# Altium schematic sheet Mic.SchDoc
size A; SheetNumber: 1; SheetTotal: 4
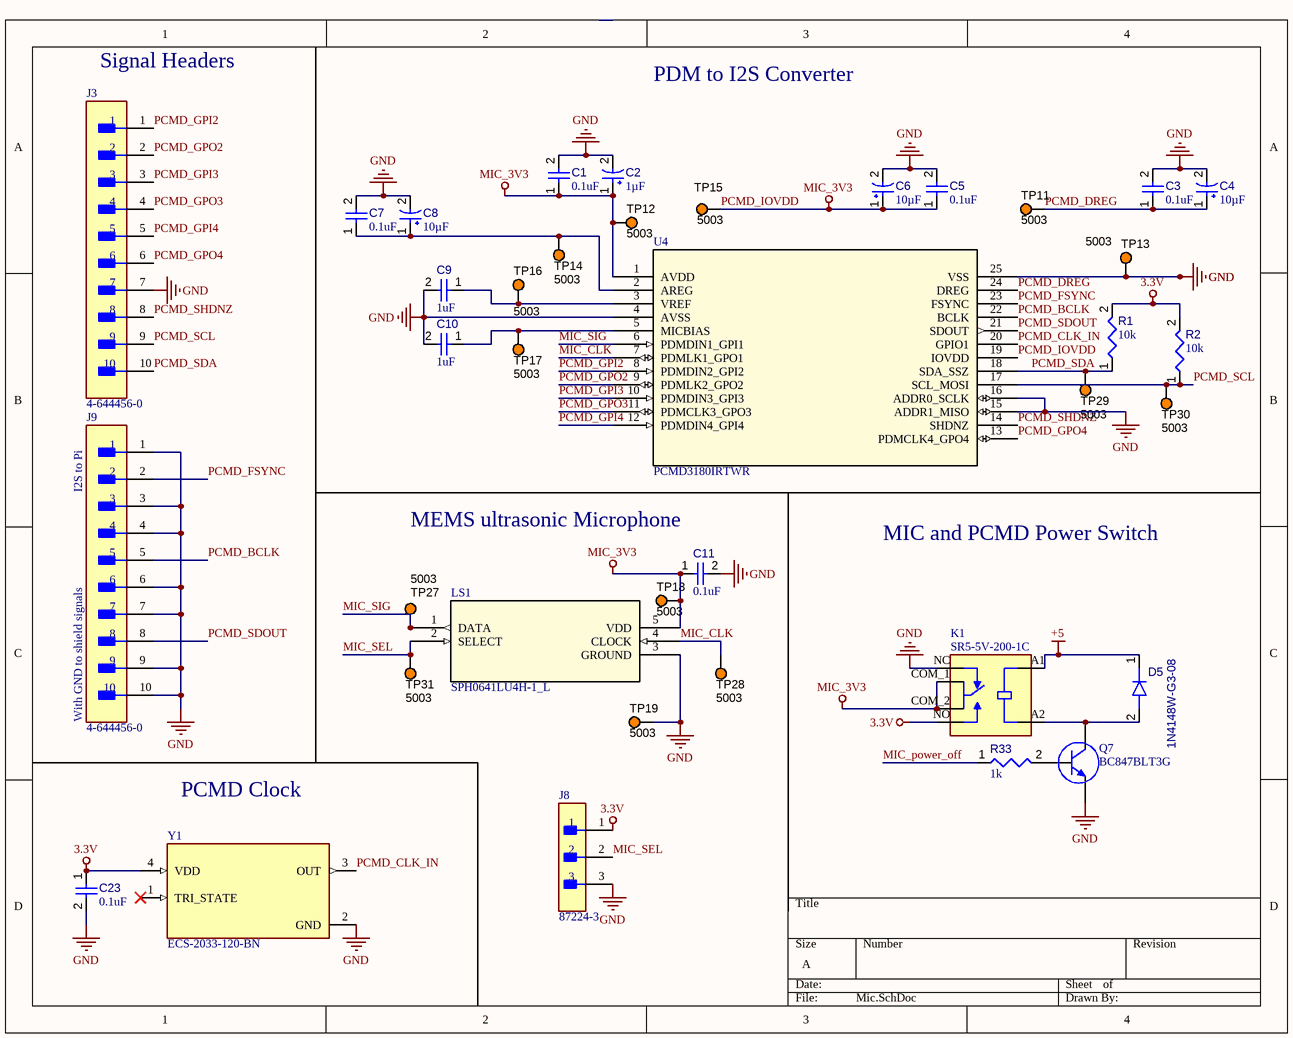
[diagram p0: Mic.SchDoc]

## Parts
C1  value 0.1uF  [CAPC1608X90X40NL10T20]  (hidden comment: Capacitor 100 nF +/-10% 50 V 0603)
C2  value 1µF  [CAPPR55-200-1100X500X1200]  (hidden comment: ECA-1HHG010)
C3  value 0.1uF  [CAPC1608X90X40NL10T20]  (hidden comment: Capacitor 100 nF +/-10% 50 V 0603)
C4  value 10µF  [CAPPR55-200-1100X500X1200]  (hidden comment: ECA-1HHG010)
C5  value 0.1uF  [CAPC1608X90X40NL10T20]  (hidden comment: Capacitor 100 nF +/-10% 50 V 0603)
C6  value 10µF  [CAPPR55-200-1100X500X1200]  (hidden comment: ECA-1HHG010)
C7  value 0.1uF  [CAPC1608X90X40NL10T20]  (hidden comment: Capacitor 100 nF +/-10% 50 V 0603)
C8  value 10µF  [CAPPR55-200-1100X500X1200]  (hidden comment: ECA-1HHG010)
C9  value 1uF  [CAPC1608X90X40NL10T20]  (hidden comment: Capacitor 100 nF +/-10% 50 V 0603)
C10  value 1uF  [CAPC1608X90X40NL10T20]  (hidden comment: Capacitor 100 nF +/-10% 50 V 0603)
C11  value 0.1uF  [CAPC1608X90X40NL10T20]  (hidden comment: Capacitor 100 nF +/-10% 50 V 0603)
C23  value 0.1uF  [CAPC1608X90X40NL10T20]  (hidden comment: Capacitor 100 nF +/-10% 50 V 0603)
D5  1N4148W-G3-08  [FP-S8-V-3910_01-001-IPC_B]
J3  4-644456-0  [FP-4-644456-0-MFG]
J8  87224-3  [FP-87224-3-MFG]
J9  4-644456-0  [FP-4-644456-0-MFG]
K1  SR5-5V-200-1C  [RELAY_SR5-5V-200-1C]
LS1  SPH0641LU4H-1_L  [SPH0655LM4H-1_KNO_L]
Q7  BC847BLT3G  [ONSC-SOT-23-3-318-08_V]
R1  value 10k  [RESC0603(1608)_L]  (hidden comment: Resistor 120R +/-5 % 0603 0.1 W)
R2  value 10k  [RESC0603(1608)_L]  (hidden comment: Resistor 120R +/-5 % 0603 0.1 W)
R33  value 1k  [RESC0603(1608)_L]  (hidden comment: Resistor 120R +/-5 % 0603 0.1 W)
TP11  5003  [KSTN-5003]
TP12  5003  [KSTN-5003]
TP13  5003  [KSTN-5003]
TP14  5003  [KSTN-5003]
TP15  5003  [KSTN-5003]
TP16  5003  [KSTN-5003]
TP17  5003  [KSTN-5003]
TP18  5003  [KSTN-5003]
TP19  5003  [KSTN-5003]
TP27  5003  [KSTN-5003]
TP28  5003  [KSTN-5003]
TP29  5003  [KSTN-5003]
TP30  5003  [KSTN-5003]
TP31  5003  [KSTN-5003]
U4  PCMD3180IRTWR  [QFN_0IRTWR_TEX]
Y1  ECS-2033-120-BN  [OSC_ECS-2033-120-BN]

## Nets
3.3V: C23.1 J8.1 K1.NO R1.2 R2.2 Y1.4(VDD)
+5: D5.1(K) K1.A1(COIL1)
GND: C1.2 C2.2 C3.2 C4.2 C5.2 C6.2 C7.2 C8.2 C9.2 C10.2 C11.2 C23.2 J3.7 J8.3 J9.1 J9.3 J9.4 J9.6 J9.7 J9.9 J9.10 K1.NC LS1.3(GROUND) Q7.1(E) TP13.1 TP19.1 U4.4(AVSS) U4.15(ADDR1_MISO) U4.16(ADDR0_SCLK) U4.25(VSS) Y1.2(GND)
PCMD_IOVDD: C1.1 C2.1 C5.1 C6.1 C11.1 K1.COM_1(COM1) K1.COM_2(COM2) LS1.5(VDD) TP12.1 TP15.1 TP18.1 U4.1(AVDD) U4.19(IOVDD)  [also labelled MIC_3V3]
MIC_CLK: LS1.4(CLOCK) TP28.1 U4.7(PDMLK1_GPO1)
MIC_power_off: R33.1
MIC_SEL: J8.2 LS1.2(SELECT) TP31.1
MIC_SIG: LS1.1(DATA) TP27.1 U4.6(PDMDIN1_GPI1)
PCMD_BCLK: J9.5 U4.22(BCLK)
PCMD_CLK_IN: U4.20(GPIO1) Y1.3(OUT)
PCMD_DREG: C3.1 C4.1 TP11.1 U4.24(DREG)
PCMD_FSYNC: J9.2 U4.23(FSYNC)
PCMD_GPI2: J3.1 U4.8(PDMDIN2_GPI2)
PCMD_GPI3: J3.3 U4.10(PDMDIN3_GPI3)
PCMD_GPI4: J3.5 U4.12(PDMDIN4_GPI4)
PCMD_GPO2: J3.2 U4.9(PDMLK2_GPO2)
PCMD_GPO3: J3.4 U4.11(PDMCLK3_GPO3)
PCMD_GPO4: J3.6 U4.13(PDMCLK4_GPO4)
PCMD_SCL: J3.9 R2.1 TP30.1 U4.17(SCL_MOSI)
PCMD_SDA: J3.10 R1.1 TP29.1 U4.18(SDA_SSZ)
PCMD_SDOUT: J9.8 U4.21(SDOUT)
PCMD_SHDNZ: J3.8 U4.14(SHDNZ)
NetC7_1: C7.1 C8.1 TP14.1 U4.2(AREG)
NetC9_1: C9.1 TP16.1 U4.3(VREF)
NetC10_1: C10.1 TP17.1 U4.5(MICBIAS)
NetD5_2: D5.2(A) K1.A2(COIL2) Q7.3(C)
NetQ7_2: Q7.2(B) R33.2

Not connected (* = marked no-connect by the designer): Y1 1(TRI_STATE)*

## Notes on the sheet
- Signal Headers
- PDM to I2S Converter
- (near J9) I2S to Pi
- (near C11) MEMS ultrasonic Microphone
- MIC and PCMD Power Switch
- (near J9) With GND to shield signals
- PCMD Clock

## Library data of the parts
C1 C3 C5 C7 C9-C11 C23 = CMP-001-00017-6: Chip Capacitor, 100 nF, +/- 10%, 50 V, 0603 (1608 Metric); Voltage Rating: 50V; Capacitor Type: Ceramic; Tolerance: 10%; Mounting Technology: SM; Max Operating Temperature: 125°C; RoHS Compliant: True; Pins: 2; Case/Package: 0603; Min Operating Temperature: -55°C
C2 C4 C6 C8 = CMP-001-00024-7: Aluminum Electrolytic Capacitor, 1 uF, +/- 20%, 50 V, -55 to 105 degC, 2-Pin THD, RoHS, Bulk; Manufacturer: Panasonic; Voltage Rating: 50V; Ripple Current: 10mA; Packaging: Bulk; Package Quantity: 200; Tolerance: 20%; Min Operating Temperature: -55°C; Diameter: 5mm; Capacitor Type: Electrolytic; Datasheet Version: Mar-05; Ripple Current (AC): 10mA; Manufacturer URL: http://www.panasonic.com/; Case/Package: Radial; Mounting Technology: TH; Pins: 2; Package Reference: CAPPR55-200-1100X500X1200; Package Description: 2-Pin Radial Lead, Dia 5 mm, Height 12 mm; RoHS Compliant: True; Max Operating Temperature: 105°C; Lead Pitch: 2mm; Datasheet URL: https://datasheet.ciiva.com/7275/94060-7275472.pdf
D5 = CMP-004-00034-1: Rectifier Diode, 1 Phase, 1 Element, 0.15A, 100V V(RRM), Silicon
J3 J9 = CMP-002-00072-1: Board Connector, 10 Contact(s), 1 Row(s), Male, Straight, 0.1 inch Pitch, Solder Terminal, Natural Insulator, Plug; Min Operating Temperature: -55°C; RoHS Compliant: Yes; Mounting Technology: Board; Max Operating Temperature: 105°C; Connector Type: BOARD CONNECTOR
J8 = CMP-002-00078-1: Board Connector, 3 Contact(s), 1 Row(s), Male, Straight, 0.1 inch Pitch, Solder Terminal, Black Insulator, Receptacle; Mounting Technology: Board; Max Operating Temperature: 105°C; RoHS Compliant: Yes; Connector Type: BOARD CONNECTOR; Min Operating Temperature: -65°C
K1 = CMP-029-000000-1: 15.6 x 10.6 x 11.8 mm, 5 V, 1 A, SPDT (1 Form C), Through Hole, Signal Relay; MF: CUI Devices; Pin Count: 6; Component Type: Standard; MP: SR5-5V-200-1C; Design Item ID: SR5-5V-200-1C; Package: None; CUI_purchase_URL: https://www.cuidevices.com/product/relays/signal-relays/sr5-5v-200-1c?utm_source=snapeda.com&utm_medium=referral&utm_campaign=snapedaBOM; Source: SR5-5V-200-1C.SchLib; SnapEDA_Link: https://www.snapeda.com/parts/SR5-5V-200-1C/CUI+Devices/view-part/?ref=snap; Value: *; Check_prices: https://www.snapeda.com/parts/SR5-5V-200-1C/CUI+Devices/view-part/?ref=eda
LS1 = CMP-00027-00004-1: No Description Available; Mfr_Name: Knowles; Source: SPH0641LU4H-1_L.SchLib; Copyright: Copyright (C) 2023 Ultra Librarian. All rights reserved.; Manufacturer_Part_Number: SPH0641LU4H-1; Design Item ID: SPH0641LU4H-1_L; Type: DEV; RefDes: RefDes
Q7 = CMP-013-00036-1: Small Signal Bipolar Transistor, 0.1A I(C), 45V V(BR)CEO, 1-Element, NPN, Silicon, TO-236; Frequency: 100MHz; RoHS Compliant: Yes; Max Operating Temperature: 150°C; Pins: 3
R1 R2 R33 = CMP-009-00176-3: Chip Resistor, 120 Ohms, +/-5 %, 0.1 W, -55 to 155 degC, 0603; Power: 100mW; Tolerance: 5%; Max Operating Temperature: 155°C; Pins: 2; Case/Package: 0603; Min Operating Temperature: -55°C
TP11-TP19 TP27-TP31 = CMP-002-00037-2: Test Point, Orange, Height 4.6 mm, Tail Length 3 mm, 1-Pin THD, RoHS; Manufacturer: Keystone; Colour: Orange; Packaging: Bulk; Package Description: 1-Pin Through Hole Device, Dia 2.54 mm; Pins: 1; Package Reference: 5003; Datasheet Version: Jun-15; Case/Package: 5003; Mounting Technology: TH; Connector Type: TestPoint; Diameter: 2.54mm; Contact Material: Bronze; Datasheet URL: http://keyelco.com/userAssets/file/M65p56.pdf; Manufacturer URL: http://www.keyelco.com/; Package Quantity: 10; Contact Plating: Tin; RoHS Compliant: True
U4 = CMP-011-000000-1: No Description Available; Mfr_Name: Texas Instruments; Source: PCMD3180IRTWR.SchLib; Design Item ID: PCMD3180IRTWR; Manufacturer_Part_Number: PCMD3180IRTWR; RefDes: RefDes; Type: DEV; Copyright: Copyright (C) 2023 Ultra Librarian. All rights reserved.
Y1 = CMP-023-000000-1: 12MHz XO (Standard) CMOS Oscillator 3.3V Enable/Disable 4-SMD, No Lead; MF: ECS Inc.; Source: ECS-2033-120-BN.SchLib; Availability: Good; Package: SMD-4 ECS International; SnapEDA_Link: https://www.snapeda.com/parts/ECS-2033-120-BN/ECS%20Inc./view-part/2724744/?ref=snap; Component Type: Standard; Value: *; Pin Count: 4; Arrow_Electronics-Purchase-URL: https://snapeda.com/shop?store=Arrow+Electronics&id=2724744; Design Item ID: ECS-2033-120-BN; Mouser-Purchase-URL: https://snapeda.com/shop?store=Mouser&id=2724744; Price: None; DigiKey-Purchase-URL: https://snapeda.com/shop?store=DigiKey&id=2724744; MP: ECS-2033-120-BN